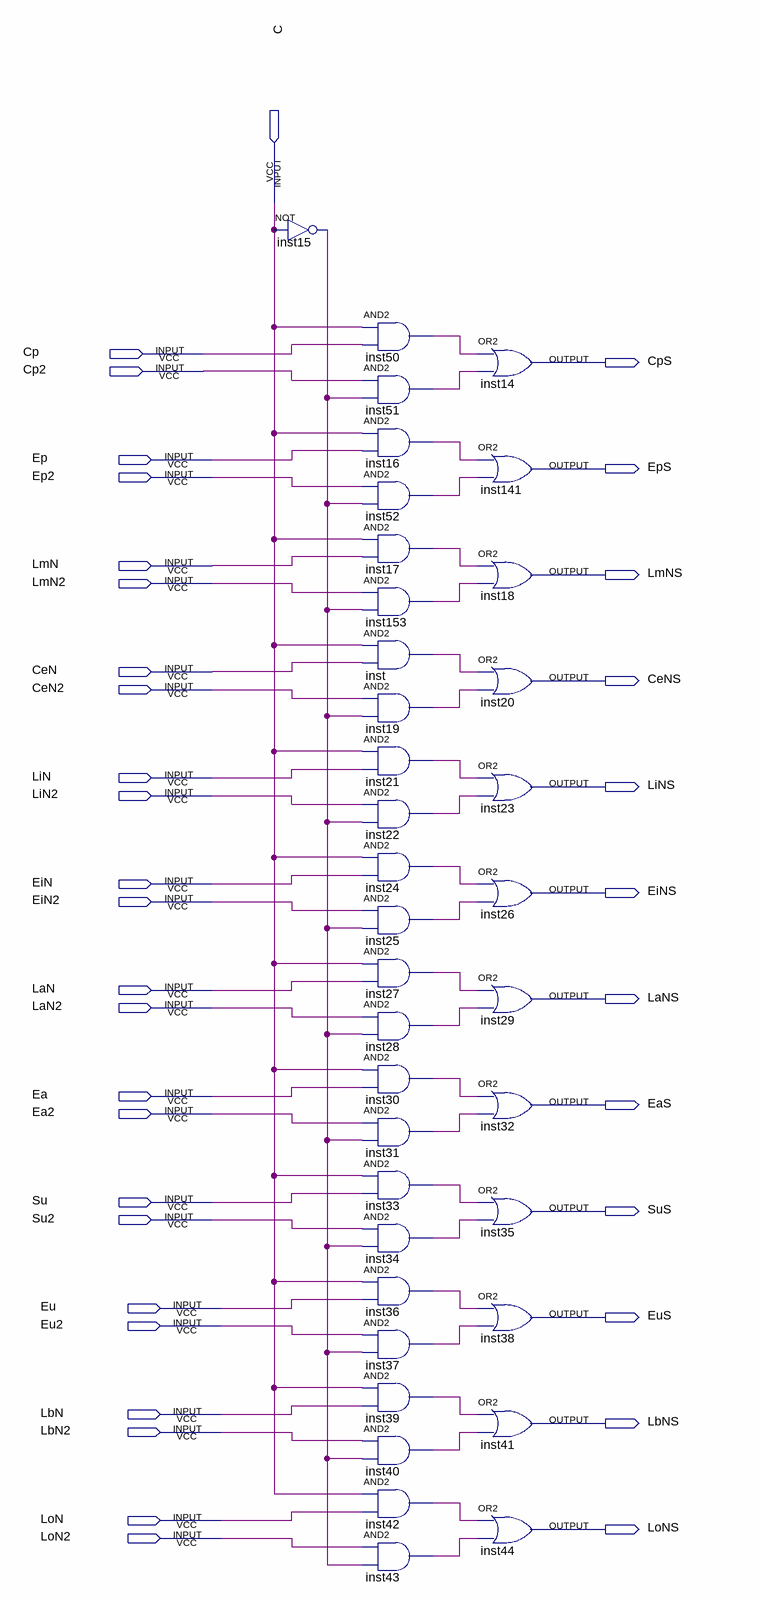
[diagram p0: schematic sheet]
// Quartus schematic Decididor.bdf as structural Verilog: 37 symbols, 37 pins
module Decididor (
  input  C,
  input  Cp,
  input  Cp2,
  input  Ep,
  input  Ep2,
  input  LmN,
  input  LmN2,
  input  CeN,
  input  CeN2,
  input  LiN,
  input  LiN2,
  input  EiN,
  input  EiN2,
  input  LaN,
  input  LaN2,
  input  Ea,
  input  Ea2,
  input  Su,
  input  Su2,
  input  Eu,
  input  Eu2,
  input  LbN,
  input  LbN2,
  input  LoN,
  input  LoN2,
  output CpS,
  output EpS,
  output LmNS,
  output CeNS,
  output LiNS,
  output EiNS,
  output LaNS,
  output EaS,
  output SuS,
  output EuS,
  output LbNS,
  output LoNS
);

  wire inst15_out, inst16_out, inst17_out, inst19_out, inst21_out, inst22_out, inst24_out, inst25_out,
       inst27_out, inst28_out, inst30_out, inst31_out, inst33_out, inst34_out, inst36_out, inst37_out,
       inst39_out, inst40_out, inst42_out, inst43_out, inst50_out, inst51_out, inst52_out, inst153_out,
       inst_out;

  not inst15 (inst15_out, C);
  and inst50 (inst50_out, C, Cp);
  and inst51 (inst51_out, Cp2, inst15_out);
  and inst16 (inst16_out, C, Ep);
  and inst52 (inst52_out, Ep2, inst15_out);
  and inst17 (inst17_out, C, LmN);
  and inst153 (inst153_out, LmN2, inst15_out);
  and inst (inst_out, C, CeN);
  and inst19 (inst19_out, CeN2, inst15_out);
  and inst21 (inst21_out, C, LiN);
  and inst22 (inst22_out, LiN2, inst15_out);
  and inst24 (inst24_out, C, EiN);
  and inst25 (inst25_out, EiN2, inst15_out);
  and inst27 (inst27_out, C, LaN);
  and inst28 (inst28_out, LaN2, inst15_out);
  and inst30 (inst30_out, C, Ea);
  and inst31 (inst31_out, Ea2, inst15_out);
  and inst33 (inst33_out, C, Su);
  and inst34 (inst34_out, Su2, inst15_out);
  and inst36 (inst36_out, C, Eu);
  and inst37 (inst37_out, Eu2, inst15_out);
  and inst39 (inst39_out, C, LbN);
  and inst40 (inst40_out, LbN2, inst15_out);
  and inst42 (inst42_out, C, LoN);
  and inst43 (inst43_out, LoN2, inst15_out);
  or inst14 (CpS, inst50_out, inst51_out);
  or inst141 (EpS, inst16_out, inst52_out);
  or inst18 (LmNS, inst17_out, inst153_out);
  or inst20 (CeNS, inst_out, inst19_out);
  or inst23 (LiNS, inst21_out, inst22_out);
  or inst26 (EiNS, inst24_out, inst25_out);
  or inst29 (LaNS, inst27_out, inst28_out);
  or inst32 (EaS, inst30_out, inst31_out);
  or inst35 (SuS, inst33_out, inst34_out);
  or inst38 (EuS, inst36_out, inst37_out);
  or inst41 (LbNS, inst39_out, inst40_out);
  or inst44 (LoNS, inst42_out, inst43_out);
endmodule
